# Altium schematic sheet 07_Misc_2.SchDoc: Misc 2 (part 1 of 2)
size A3; Organization: Lime Microsystems; Address1: Surrey Tech Centre; Address2: Guildford GU2 7YG; Address3: Surrey; Address4: United Kingdom; Revision: v1.3; SheetNumber: 7; SheetTotal: 13
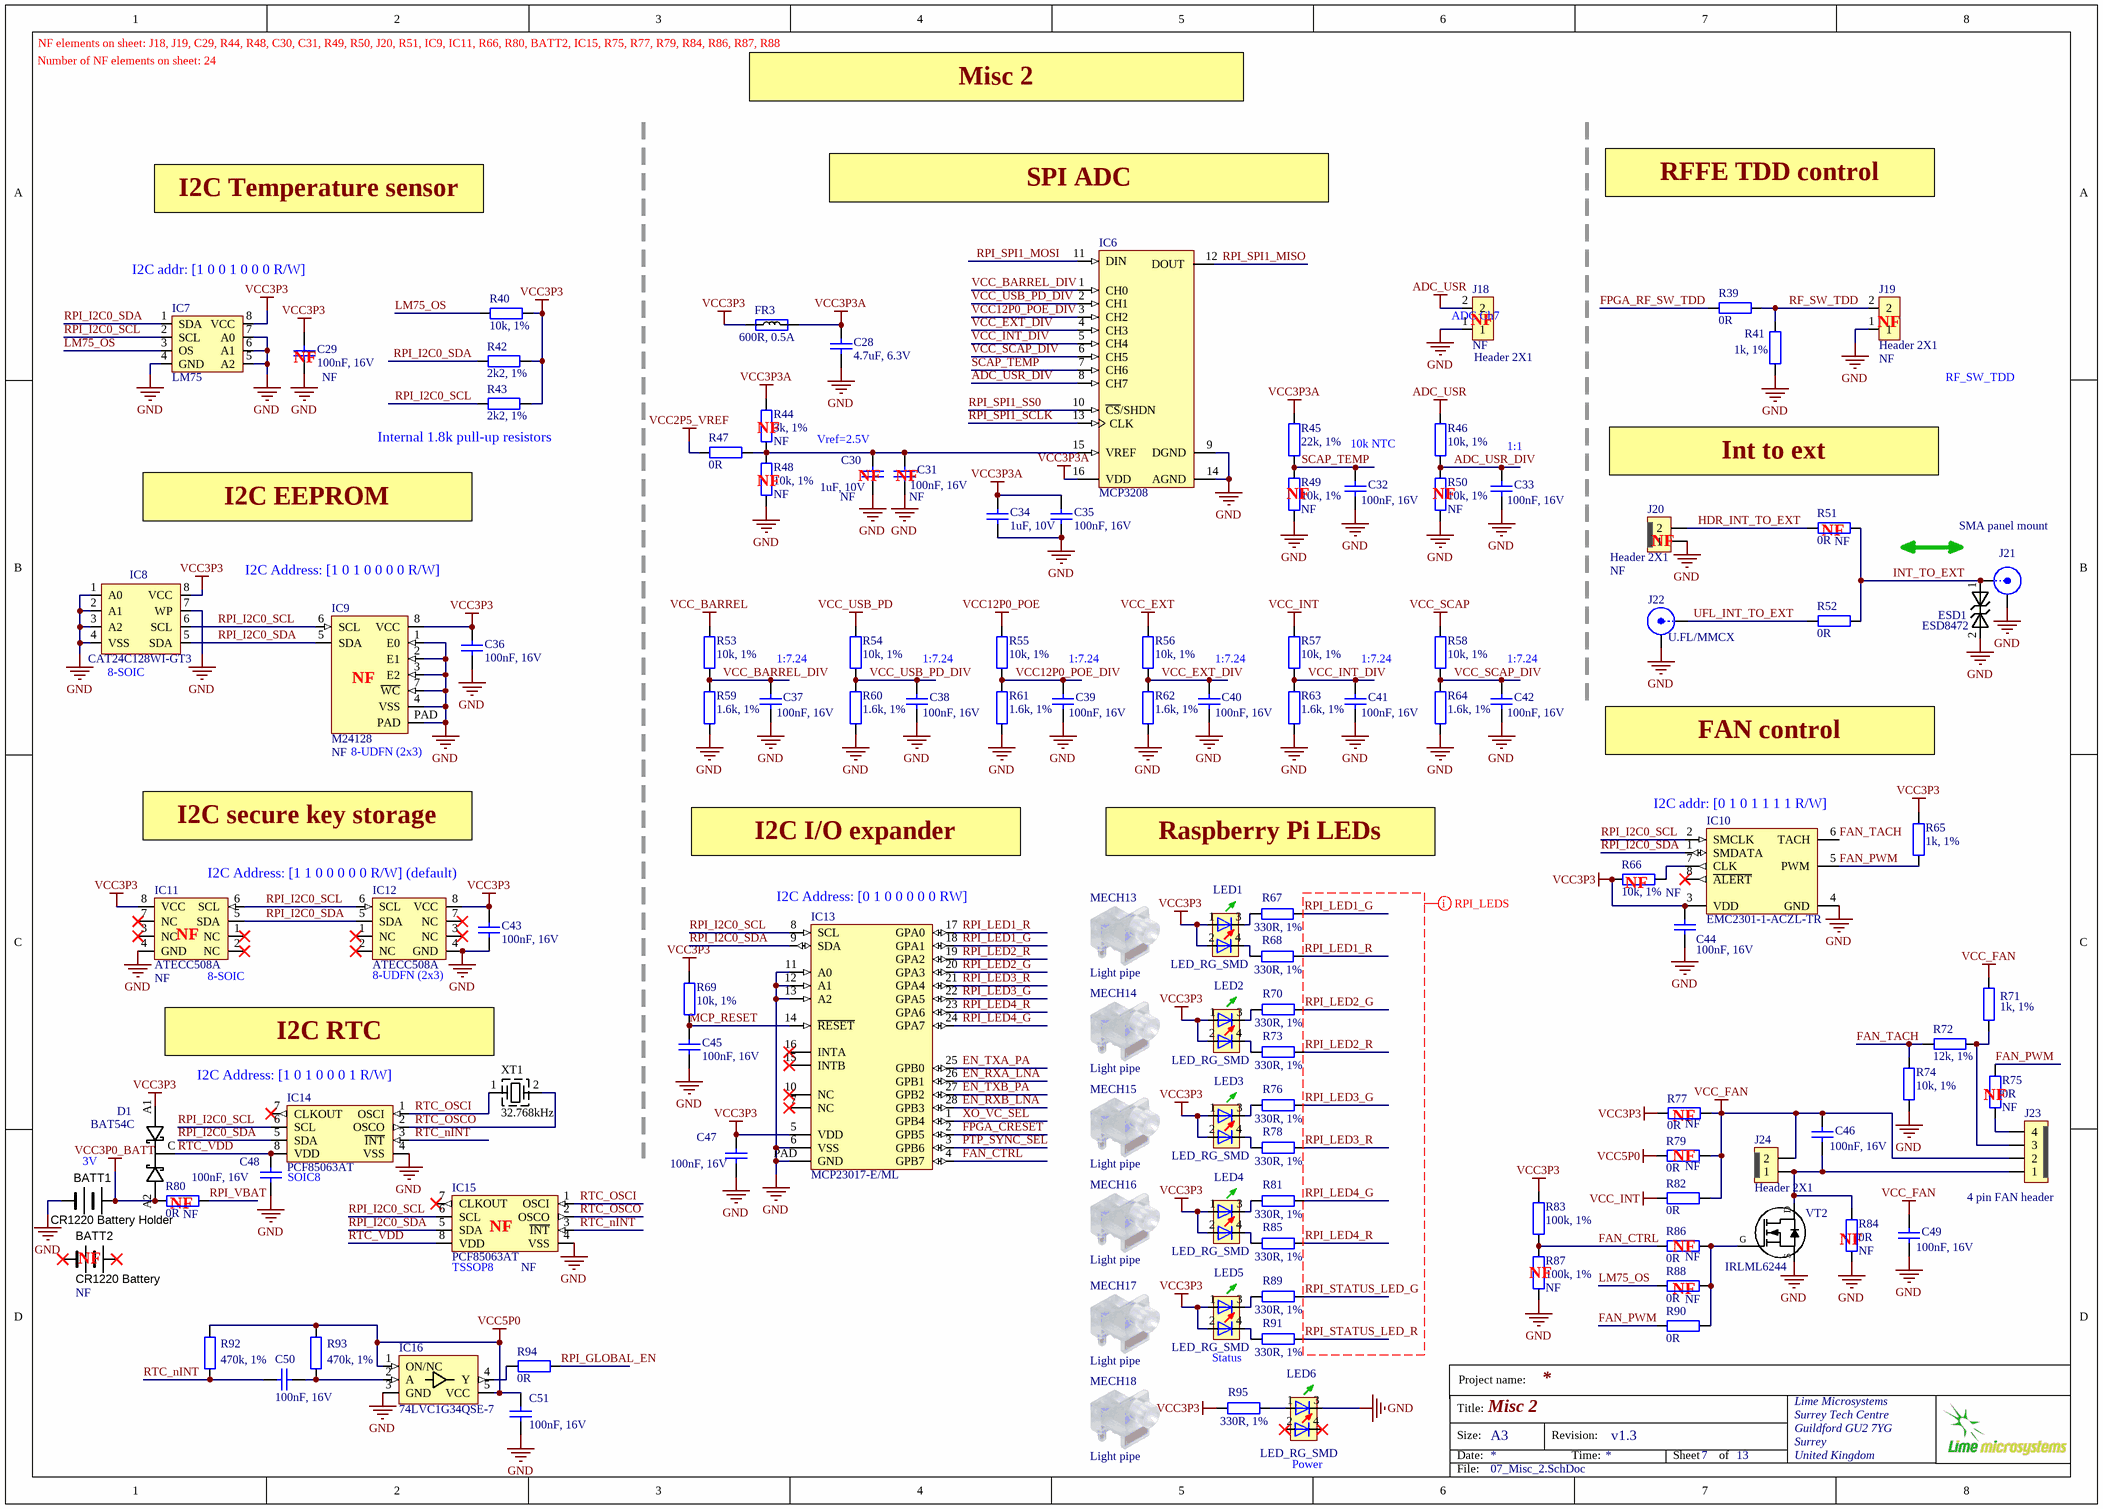
[diagram p0: 07_Misc_2.SchDoc]

## Parts
BATT1  CR1220 Battery Holder  [CR1220_SMD_holder]
BATT2  CR1220 Battery  Assembly Info: NF  (mechanical)
C28  4.7uF, 6.3V  [CAP0402]
C29  100nF, 16V  Assembly Info: NF  [CAP0402]
C30  1uF, 10V  Assembly Info: NF  [CAP0402]
C31  100nF, 16V  Assembly Info: NF  [CAP0402]
C32  100nF, 16V  [CAP0402]
C33  100nF, 16V  [CAP0402]
C34  1uF, 10V  [CAP0402]
C35  100nF, 16V  [CAP0402]
C36  100nF, 16V  [CAP0402]
C37  100nF, 16V  [CAP0402]
C38  100nF, 16V  [CAP0402]
C39  100nF, 16V  [CAP0402]
C40  100nF, 16V  [CAP0402]
C41  100nF, 16V  [CAP0402]
C42  100nF, 16V  [CAP0402]
C43  100nF, 16V  [CAP0402]
C44  100nF, 16V  [CAP0402]
C45  100nF, 16V  [CAP0402]
C46  100nF, 16V  [CAP0402]
C47  100nF, 16V  [CAP0402]
C48  100nF, 16V  [CAP0402]
C49  100nF, 16V  [CAP0402]
C50  100nF, 16V  [CAP0402]
C51  100nF, 16V  [CAP0402]
D1  BAT54C  [BAT54C_SOT23-3]
ESD1  ESD8472  [ESD8472_X3DFN2]
FR3  600R, 0.5A  [RES0402]
IC6  MCP3208  [MCP3208-CI/SL_SOIC16]
IC7  LM75  [HWSON8_LM75]
IC8  CAT24C128WI-GT3  [SOIC127P600-8DL_v2]
IC9  M24128  Assembly Info: NF  [M24128-DFMC6TG]
IC10  EMC2301-1-ACZL-TR  [EMC2301-1-ACZL-TR_MOTOR_DRIVER_TSSOP8]
IC11  ATECC508A  Assembly Info: NF  [SOIC127P600-8DL_v2]
IC12  ATECC508A  [ATECC508A_UDFN8]
IC13  MCP23017-E/ML  [MCP23017-E/ML_QFN28]
IC14  PCF85063AT  [PCF85063AT_RTC_SOIC-8]
IC15  PCF85063AT  Assembly Info: NF  [PCF85063AT_RTC_TSSOP8]
IC16  74LVC1G34QSE-7  [74AHCT1G126SE-7_BUFFER_SOT353]
J18  Header 2X1  Assembly Info: NF  [HDR_1x2]
J19  Header 2X1  Assembly Info: NF  [HDR_1x2]
J20  Header 2X1  Assembly Info: NF  [Header1x2_TH_LOCKING]
J21  SMA panel mount  [SMA_connector_side]
J22  U.FL/MMCX  [MMCX_UFL_conn_u]
J23  4 pin FAN header  [Header1x4_TH_LOCKING_v2]
J24  Header 2X1  [Header1x2_TH_LOCKING]
LED1  LED_RG_SMD  [LED-2x0603]
LED2  LED_RG_SMD  [LED-2x0603]
LED3  LED_RG_SMD  [LED-2x0603]
LED4  LED_RG_SMD  [LED-2x0603]
LED5  LED_RG_SMD  [LED-2x0603]
LED6  LED_RG_SMD  [LED-2x0603]
MECH13  Light pipe  [LIGHT_PIPE_RIGHT_ANGLE_SLP3-200-100-F]
MECH14  Light pipe  [LIGHT_PIPE_RIGHT_ANGLE_SLP3-200-100-F]
MECH15  Light pipe  [LIGHT_PIPE_RIGHT_ANGLE_SLP3-200-100-F]
MECH16  Light pipe  [LIGHT_PIPE_RIGHT_ANGLE_SLP3-200-100-F]
MECH17  Light pipe  [LIGHT_PIPE_RIGHT_ANGLE_SLP3-200-100-F]
MECH18  Light pipe  [LIGHT_PIPE_RIGHT_ANGLE_SLP3-200-100-F]
R39  0R  [RES0402]
R40  10k, 1%  [RES0402]
R41  1k, 1%  [RES0402]
R42  2k2, 1%  [RES0402]
R43  2k2, 1%  [RES0402]
R44  3k, 1%  Assembly Info: NF  [RES0402]
R45  22k, 1%  [RES0402]
R46  10k, 1%  [RES0402]
R47  0R  [RES0402_v2]
R48  10k, 1%  Assembly Info: NF  [RES0402]
R49  10k, 1%  Assembly Info: NF  [RES0402]
R50  10k, 1%  Assembly Info: NF  [RES0402]
R51  0R  Assembly Info: NF  [RES0402_v2]
R52  0R  [RES0402_v2]
R53  10k, 1%  [RES0402]
R54  10k, 1%  [RES0402]
R55  10k, 1%  [RES0402]
R56  10k, 1%  [RES0402]
R57  10k, 1%  [RES0402]
R58  10k, 1%  [RES0402]
R59  1.6k, 1%  [RES0402]
R60  1.6k, 1%  [RES0402]
R61  1.6k, 1%  [RES0402]
R62  1.6k, 1%  [RES0402]
R63  1.6k, 1%  [RES0402]
R64  1.6k, 1%  [RES0402]
R65  1k, 1%  [RES0402]
R66  10k, 1%  Assembly Info: NF  [RES0402]
R67  330R, 1%  [RES0402]
R68  330R, 1%  [RES0402]
R69  10k, 1%  [RES0402]
R70  330R, 1%  [RES0402]
R71  1k, 1%  [RES0402]
R72  12k, 1%  [RES0402]
R73  330R, 1%  [RES0402]
R74  10k, 1%  [RES0402]
R75  0R  Assembly Info: NF  [RES0402]
R76  330R, 1%  [RES0402]
R77  0R  Assembly Info: NF  [RES0402]
R78  330R, 1%  [RES0402]
R79  0R  Assembly Info: NF  [RES0402]
R80  0R  Assembly Info: NF  [RES0402]
R81  330R, 1%  [RES0402]
R82  0R  [RES0402]
R83  100k, 1%  [RES0402]
R84  0R  Assembly Info: NF  [RES0402]
R85  330R, 1%  [RES0402]
R86  0R  Assembly Info: NF  [RES0402]
R87  100k, 1%  Assembly Info: NF  [RES0402]
R88  0R  Assembly Info: NF  [RES0402]
R89  330R, 1%  [RES0402]
R90  0R  [RES0402]
R91  330R, 1%  [RES0402]
R92  470k, 1%  [RES0402]
R93  470k, 1%  [RES0402]
R94  0R  [RES0402]
R95  330R, 1%  [RES0402]
VT2  IRLML6244  [SOT23-3]
XT1  32.768kHz  [CRYSTAL_2PIN_RTC_RT3215]

## Nets
ADC_USR: J18.2 R46.1
GND: BATT1.NEGATIVE C28.1 C29.2 C30.1 C31.2 C32.2 C33.2 C34.1 C35.1 C36.2 C37.2 C38.2 C39.2 C40.2 C41.2 C42.2 C43.2 C44.2 C45.2 C47.2 C48.2 C49.2 C51.2 ESD1.2 IC6.9(DGND) IC6.14(AGND) IC7.4(GND) IC7.5(A2) IC7.6(A1) IC7.7(A0) IC8.1(A0) IC8.2(A1) IC8.3(A2) IC8.4(VSS) IC8.7(WP) IC9.1(E0) IC9.2(E1) IC9.3(E2) IC9.4(VSS) IC9.7(~{WC}) IC9.PAD IC10.4(GND) IC11.4(GND) IC12.4(GND) IC13.6(VSS) IC13.11(A0) IC13.12(A1) IC13.13(A2) IC13.PAD(GND) IC14.4(VSS) IC15.4(VSS) IC16.3(GND) J18.1 J19.1 J20.1 J21.2(Y) J22.2(Y) LED6.3 R41.2 R48.2 R49.2 R50.2 R59.1 R60.1 R61.1 R62.1 R63.1 R64.1 R74.2 R84.1 R87.2 VT2.S
VCC2P5_VREF: R47.1
VCC3P0_BATT: BATT1.POSITIVE D1.A2 R80.2
VCC3P3: C29.1 C36.1 C43.1 C44.1 C47.1 D1.A1 FR3.1 IC7.8(VCC) IC8.8(VCC) IC9.8(VCC) IC10.3(VDD) IC11.8(VCC) IC12.8(VCC) IC13.5(VDD) LED1.1 LED1.2 LED2.1 LED2.2 LED3.1 LED3.2 LED4.1 LED4.2 LED5.1 LED5.2 R40.2 R42.2 R43.2 R65.2 R66.1 R69.2 R77.1 R83.1 R95.2
VCC3P3A: C28.2 C34.2 C35.2 FR3.2 IC6.16(VDD) R44.2 R45.1
VCC5P0: C51.1 IC16.1(ON/NC) IC16.5(VCC) R79.1 R92.2 R93.2
VCC12P0_POE: R55.1
VCC_BARREL: R53.1
VCC_EXT: R56.1
VCC_FAN: C46.1 C49.1 J23.2 J24.2 R71.1 R77.2 R79.2 R82.2
VCC_INT: R57.1 R82.1
VCC_SCAP: R58.1
VCC_USB_PD: R54.1
ADC_USR_DIV: C33.1 IC6.8(CH7) R46.2 R50.1
EN_RXA_LNA: IC13.26(GPB1)
EN_RXB_LNA: IC13.28(GPB3)
EN_TXA_PA: IC13.25(GPB0)
EN_TXB_PA: IC13.27(GPB2)
FAN_CTRL: IC13.4(GPB7) R83.2 R86.1 R87.1
FAN_PWM: IC10.5(PWM) R65.1 R75.2 R90.1
FAN_TACH: IC10.6(TACH) R72.2 R74.1
FPGA_CRESET: IC13.2(GPB5)
FPGA_RF_SW_TDD: R39.2
HDR_INT_TO_EXT: J20.2 R51.2
INT_TO_EXT: ESD1.1 J21.1(X) R51.1 R52.1
LM75_OS: IC7.3(OS) R40.1 R88.1
MCP_RESET: C45.1 IC13.14(~{RESET}) R69.1
PTP_SYNC_SEL: IC13.3(GPB6)
RF_SW_TDD: J19.2 R39.1 R41.1
RPI_GLOBAL_EN: R94.1
RPI_I2C0_SCL: IC7.2(SCL) IC8.6(SCL) IC9.6(SCL) IC10.2(SMCLK) IC11.6(SCL) IC12.6(SCL) IC13.8(SCL) IC14.6(SCL) IC15.6(SCL) R43.1
RPI_I2C0_SDA: IC7.1(SDA) IC8.5(SDA) IC9.5(SDA) IC10.1(SMDATA) IC11.5(SDA) IC12.5(SDA) IC13.9(SDA) IC14.5(SDA) IC15.5(SDA) R42.1
RPI_LED1_G: IC13.18(GPA1) R67.1
RPI_LED1_R: IC13.17(GPA0) R68.1
RPI_LED2_G: IC13.20(GPA3) R70.1
RPI_LED2_R: IC13.19(GPA2) R73.1
RPI_LED3_G: IC13.22(GPA5) R76.1
RPI_LED3_R: IC13.21(GPA4) R78.1
RPI_LED4_G: IC13.24(GPA7) R81.1
RPI_LED4_R: IC13.23(GPA6) R85.1
RPI_SPI1_MISO: IC6.12(DOUT)
RPI_SPI1_MOSI: IC6.11(DIN)
RPI_SPI1_SCLK: IC6.13(CLK)
RPI_SPI1_SS0: IC6.10(~{CS}/SHDN)
RPI_STATUS_LED_G: R89.1
RPI_STATUS_LED_R: R91.1
RPI_VBAT: R80.1
RTC_nINT: C50.1 IC14.3(~{INT}) IC15.3(~{INT}) R92.1
RTC_OSCI: IC14.1(OSCI) IC15.1(OSCI) XT1.1(X)
RTC_OSCO: IC14.2(OSCO) IC15.2(OSCO) XT1.2(X)
RTC_VDD: C48.1 D1.C IC14.8(VDD) IC15.8(VDD)
SCAP_TEMP: C32.1 IC6.7(CH6) R45.2 R49.1
UFL_INT_TO_EXT: J22.1(X) R52.2
VCC12P0_POE_DIV: C39.1 IC6.3(CH2) R55.2 R61.2
VCC_BARREL_DIV: C37.1 IC6.1(CH0) R53.2 R59.2
VCC_EXT_DIV: C40.1 IC6.4(CH3) R56.2 R62.2
VCC_INT_DIV: C41.1 IC6.5(CH4) R57.2 R63.2
VCC_SCAP_DIV: C42.1 IC6.6(CH5) R58.2 R64.2
VCC_USB_PD_DIV: C38.1 IC6.2(CH1) R54.2 R60.2
XO_VC_SEL: IC13.1(GPB4)
NetC30_2: C30.2 C31.1 IC6.15(VREF) R44.1 R47.2 R48.1
NetC46_2: C46.2 J23.1 J24.1 R84.2 VT2.D
NetC50_2: C50.2 IC16.2(A) R93.1
NetIC10_7: IC10.7(CLK) R66.2
NetIC16_4: IC16.4(Y) R94.2
NetJ23_3: J23.3 R71.2 R72.1
NetJ23_4: J23.4 R75.1
NetLED1_3: LED1.3 R67.2
NetLED1_4: LED1.4 R68.2
NetLED2_3: LED2.3 R70.2
NetLED2_4: LED2.4 R73.2
NetLED3_3: LED3.3 R76.2
NetLED3_4: LED3.4 R78.2
NetLED4_3: LED4.3 R81.2
NetLED4_4: LED4.4 R85.2
NetLED5_3: LED5.3 R89.2
NetLED5_4: LED5.4 R91.2
NetLED6_1: LED6.1 R95.1
NetR86_2: R86.2 R88.2 R90.2 VT2.G

Not connected (* = marked no-connect by the designer): BATT2 NEGATIVE* POSITIVE*; IC10 8(~{ALERT})*; IC11 1(NC)* 2(NC)* 3(NC)* 7(NC)*; IC12 1(NC)* 2(NC)* 3(NC)* 7(NC)*; IC13 7(NC)* 10(NC)* 15(INTB)* 16(INTA)*; IC14 7(CLKOUT)*; IC15 7(CLKOUT)*; LED6 2* 4*

## Layout directives
net class RPI_LEDS: RPI_LED1_G, RPI_LED1_R, RPI_LED2_G, RPI_LED2_R, RPI_LED3_G, RPI_LED3_R, RPI_LED4_G, RPI_LED4_R, RPI_STATUS_LED_G, RPI_STATUS_LED_R

## Notes on the sheet
- NF elements on sheet: J18, J19, C29, R44, R48, C30, C31, R49, R50, J20, R51, IC9, IC11, R66, R80, BATT2, IC15, R75, R77, R79, R84, R86, R87, R88
- Number of NF elements on sheet: 24
- Misc 2
- I2C Temperature sensor
- SPI ADC
- RFFE TDD control
- I2C addr: [1 0 0 1 0 0 0 R/W]
- (near C29) NF
- (near J18) ADC Ch7
- (near J18) NF
- (near J19) NF
- (near J19) RF_SW_TDD
- (near R43) Internal 1.8k pull-up resistors
- (near R44) NF
- (near C30) Vref=2.5V
- 10k NTC
- (near C33) 1:1
- I2C EEPROM
- (near R48) NF
- (near C30) NF
- (near C31) NF
- (near R49) NF
- (near R50) NF
- Int to ext
- I2C Address: [1 0 1 0 0 0 0 R/W]
- (near J20) NF
- (near R51) NF
- (near IC8) 8-SOIC
- (near IC9) NF
- 1:7.24
- (near C42) 1:7.24
- (near IC9) 8-UDFN (2x3)
- FAN control
- I2C secure key storage
- I2C I/O expander
- Raspberry Pi LEDs
- (near IC10) I2C addr: [0 1 0 1 1 1 1 R/W]
- I2C Address: [1 1 0 0 0 0 0 R/W] (default)
- (near IC13) I2C Address: [0 1 0 0 0 0 0 RW]
- (near R66) NF
- (near IC11) NF
- (near IC11) 8-SOIC
- (near IC12) 8-UDFN (2x3)
- I2C RTC
- (near IC14) I2C Address: [1 0 1 0 0 0 1 R/W]
- (near R77) NF
- (near R75) NF
- (near BATT1) 3V
- SOIC8
- (near R79) NF
- (near R80) NF
- (near IC15) NF
- (near R86) NF
- (near R84) NF
- (near BATT2) NF
- (near IC15) TSSOP8
- (near R87) NF
- (near R88) NF
- Status
- (near LED6) Power
- Project name:
- Title:
- Size:
- Date:
- A3
- Revision:
- Time:
- Sheet
- of
- File: